# EAGLE schematic tempThermostat (EAGLE 6.3)
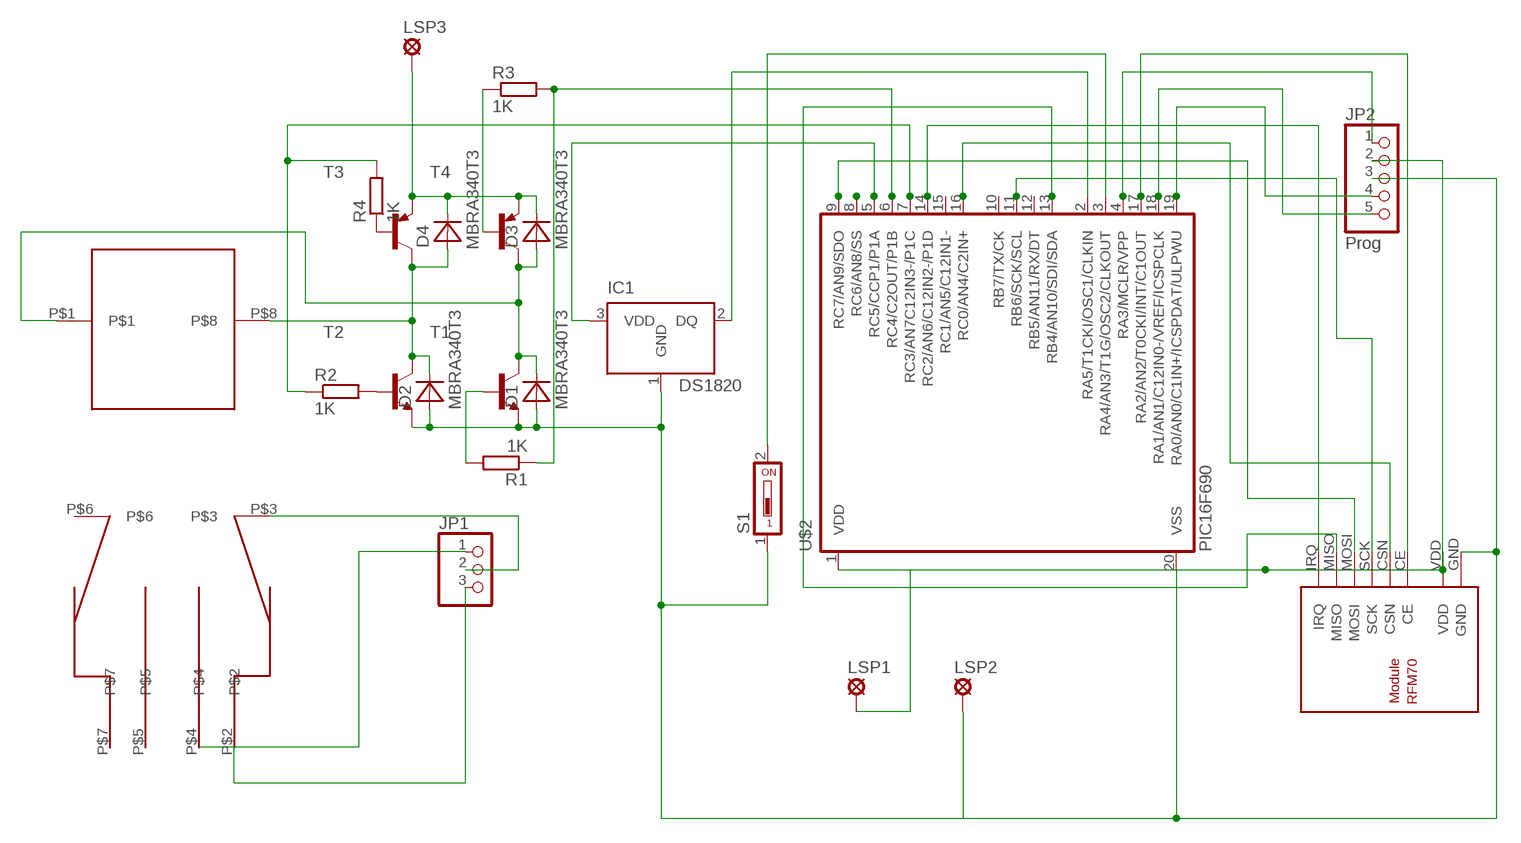
[diagram p0: schematic, sheet 1]

## Parts
D1  MBRA340T3  [SMA]
D2  MBRA340T3  [SMA]
D3  MBRA340T3  [SMA]
D4  MBRA340T3  [SMA]
IC1  DS1820  [TO-92]
JP1  PINHD-1X3  [1X03]
JP2  Prog  PINHD-1X5  [1X05]
LSP1  LSP11  [LSP11]
LSP2  LSP11  [LSP11]
LSP3  LSP11  [LSP11]
R1  1K  R-EU_R1206  [R1206]
R2  1K  R-EU_R1206  [R1206]
R3  1K  R-EU_R1206  [R1206]
R4  1K  R-EU_R1206  [R1206]
S1  SD4-01  [SD4-01]
T1  BC817-40-NPN-SOT23-BEC  [SOT23-BEC]
T2  BC817-40-NPN-SOT23-BEC  [SOT23-BEC]
T3  BC807-16-PNP-SOT23-BEC  [SOT23-BEC]
T4  BC807-16-PNP-SOT23-BEC  [SOT23-BEC]
U$1  RFM70  [RFM70]
U$2  PIC16F690  [SSOP20]
U$3  RELAYBISTABILDIP  [DIP]

## Nets
N$1: IC1.2(DQ) U$2.2(RA5/T1CKI/OSC1/CLKIN)
N$2: JP1.3 U$3.P$2
N$3: IC1.3(VDD) U$2.5(RC5/CCP1/P1A)
N$5: D1.A D2.A IC1.1(GND) JP2.3 LSP2.MP S1.1 T1.E T2.E U$1.GND U$2.20(VSS)
N$6: S1.2 U$2.3(RA4/AN3/T1G/OSC2/CLKOUT)
N$7: D2.C D4.A T2.C T3.C U$3.P$8
N$8: D1.C D3.A T1.C T4.C U$3.P$1
N$9: JP1.1 U$3.P$4
N$10: JP1.2 U$3.P$3
N$11: D3.C D4.C LSP3.MP T3.E T4.E
N$12: U$1.MISO U$2.13(RB4/AN10/SDI/SDA)
N$13: R2.2 T2.B
N$14: R4.1 T3.B
N$16: U$1.CE U$2.17(RA2/AN2/T0CKI/INT/C1OUT)
N$17: JP2.2 LSP1.MP U$1.VDD U$2.1(VDD)
N$18: JP2.4 U$2.19(RA0/AN0/C1IN+/ICSPDAT/ULPWU)
N$19: JP2.5 U$2.18(RA1/AN1/C12IN0-/VREF/ICSPCLK)
N$20: U$1.CSN U$2.16(RC0/AN4/C2IN+)
N$21: U$1.IRQ U$2.14(RC2/AN6/C12IN2-/P1D)
N$22: U$1.SCK U$2.11(RB6/SCK/SCL)
N$23: U$1.MOSI U$2.9(RC7/AN9/SDO)
N$24: R1.2 T1.B
N$25: JP2.1 U$2.4(RA3/MCLR/VPP)
N$27: R3.1 T4.B
N$28: U$2.8(RC6/AN8/SS)
N$30: R1.1 R3.2 U$2.6(RC4/C2OUT/P1B)
N$31: R2.1 R4.2 U$2.7(RC3/AN7C12IN3-/P1C)
Unconnected: U$2.10(RB7/TX/CK) U$2.12(RB5/AN11/RX/DT) U$2.15(RC1/AN5/C12IN1-) U$3.P$5 U$3.P$6 U$3.P$7

## Library data of the parts
D1-D4 = diode:MBRA340T3: Surface Mount Schottky Power Rectifier Source: http://www.onsemi.com/pub_link/Collateral/MBRA340T3-D.PDF
IC1 = ds1820:DS1820: DS1820 - 1-Wire Digital Thermometer
JP1 = pinhead:PINHD-1X3: PIN HEADER
JP2 = pinhead:PINHD-1X5: PIN HEADER
LSP1-LSP3 = solpad:LSP11: SOLDER PAD drill 1.1 mm
R1-R4 = resistor:R-EU_: RESISTOR, European symbol
S1 = switch-dil:SD4-01: DIL/CODE SWITCH; OC_FARNELL: unknown; OC_NEWARK: unknown
T1 T2 = transistor:*-NPN-: NPN Transistror BF959 corrected 2008.03.06
T3 T4 = transistor:*-PNP-: PNP Transistror
U$1 = rfm70:RFM70: RFM70 2.4 Ghz Funkmodul Autor: Daniel Weber Website: http://projects.web4clans.com Email: daniel.weber@web4clans.com
U$2 = microchip:PIC16F690*: MICROCONTROLLER PIC16F690 18 I/O One 16-bit timer Two 8-bit timer Two comparators Precision internal oscillator-software selectable 8 MHz - 32 KHz SSP w/ I2C Compatible Address mask option EUSART LIN 2.0 Compatible ECCP+ w/ PWM Steering 12 A/D Channels ULPW Enhanced Low Power Timer 1 Timer 1 Gate Synch Latch 4k Program Flash memory 256 bytes SRAM 256 bytes EEPROM
U$3 = relay-Fujitsu:RELAYBISTABIL: a